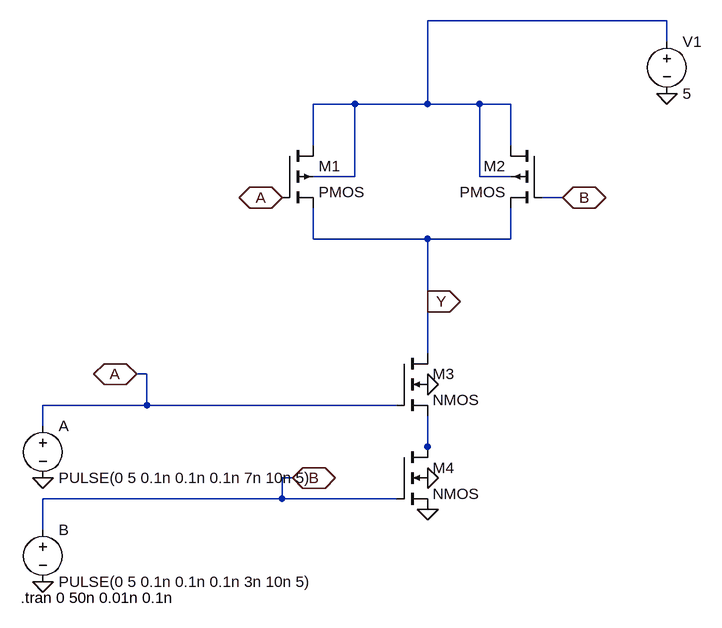
[diagram p0: schematic nand.asc]
nand.asc, the LTspice schematic file:
Version 4
SHEET 1 880 680
WIRE 400 -336 32 -336
WIRE 400 -304 400 -336
WIRE -80 -208 -144 -208
WIRE 32 -208 32 -336
WIRE 32 -208 -80 -208
WIRE 112 -208 32 -208
WIRE 160 -208 112 -208
WIRE -144 -144 -144 -208
WIRE 160 -144 160 -208
WIRE -80 -96 -80 -208
WIRE -80 -96 -144 -96
WIRE 112 -96 112 -208
WIRE 160 -96 112 -96
WIRE 240 -64 208 -64
WIRE -144 0 -144 -48
WIRE 32 0 -144 0
WIRE 160 0 160 -48
WIRE 160 0 32 0
WIRE 32 96 32 0
WIRE 32 176 32 96
WIRE -400 208 -416 208
WIRE -400 256 -400 208
WIRE -400 256 -560 256
WIRE -16 256 -400 256
WIRE -560 288 -560 256
WIRE 32 320 32 272
WIRE 32 336 32 320
WIRE -176 368 -192 368
WIRE -192 400 -192 368
WIRE -192 400 -560 400
WIRE -16 400 -192 400
WIRE -560 448 -560 400
FLAG 32 224 0
FLAG 32 368 0
FLAG 32 416 0
FLAG -560 368 0
FLAG -560 528 0
FLAG 400 -224 0
FLAG -416 208 A
IOPIN -416 208 BiDir
FLAG -192 -64 A
IOPIN -192 -64 BiDir
FLAG -176 368 B
IOPIN -176 368 BiDir
FLAG 240 -64 B
IOPIN 240 -64 BiDir
FLAG 32 96 Y
IOPIN 32 96 Out
SYMBOL pmos4 -192 -144 R0
SYMATTR InstName M1
SYMBOL pmos4 208 -144 M0
SYMATTR InstName M2
SYMBOL nmos4 -16 176 R0
SYMATTR InstName M3
SYMBOL nmos4 -16 320 R0
SYMATTR InstName M4
SYMBOL voltage -560 432 R0
WINDOW 123 0 0 Left 2
WINDOW 39 0 0 Left 2
SYMATTR InstName B
SYMATTR Value PULSE(0 5 0.1n 0.1n 0.1n 3n 10n 5)
SYMBOL voltage -560 272 R0
WINDOW 123 0 0 Left 2
WINDOW 39 0 0 Left 2
SYMATTR InstName A
SYMATTR Value PULSE(0 5 0.1n 0.1n 0.1n 7n 10n 5)
SYMBOL voltage 400 -320 R0
WINDOW 123 0 0 Left 2
WINDOW 39 0 0 Left 2
SYMATTR InstName V1
SYMATTR Value 5
TEXT -594 552 Left 2 !.tran 0 50n 0.01n 0.1n

The netlist it stands for:
* nand.asc
M1 N001 A Y N001 PMOS
M2 N001 B Y N001 PMOS
M3 Y A N002 0 NMOS
M4 N002 B 0 0 NMOS
V§B B 0 PULSE(0 5 0.1n 0.1n 0.1n 3n 10n 5)
V§A A 0 PULSE(0 5 0.1n 0.1n 0.1n 7n 10n 5)
V1 N001 0 5
.model NMOS NMOS
.model PMOS PMOS
.lib standard.mos
.tran 0 50n 0.01n 0.1n
.backanno
.end

* Results of the author's LTspice run, read from the files saved beside the schematic
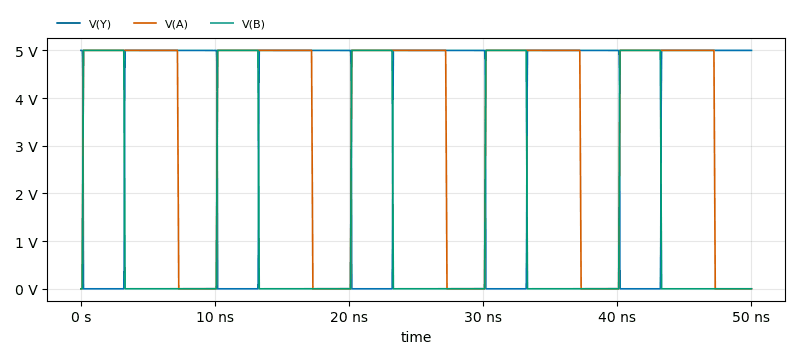
[diagram p1: Transient Analysis of nand.asc, plotted from the saved traces]
* Transient Analysis, 1 run:
*   V(Y): min 0 V, max 5 V, average 3.457 V, rms 4.152 V, last 5 V
*   V(A): min 0 V, max 5 V, average 3.551 V, rms 4.204 V, last 0 V
*   V(B): min 0 V, max 5 V, average 1.55 V, rms 2.77 V, last 0 V